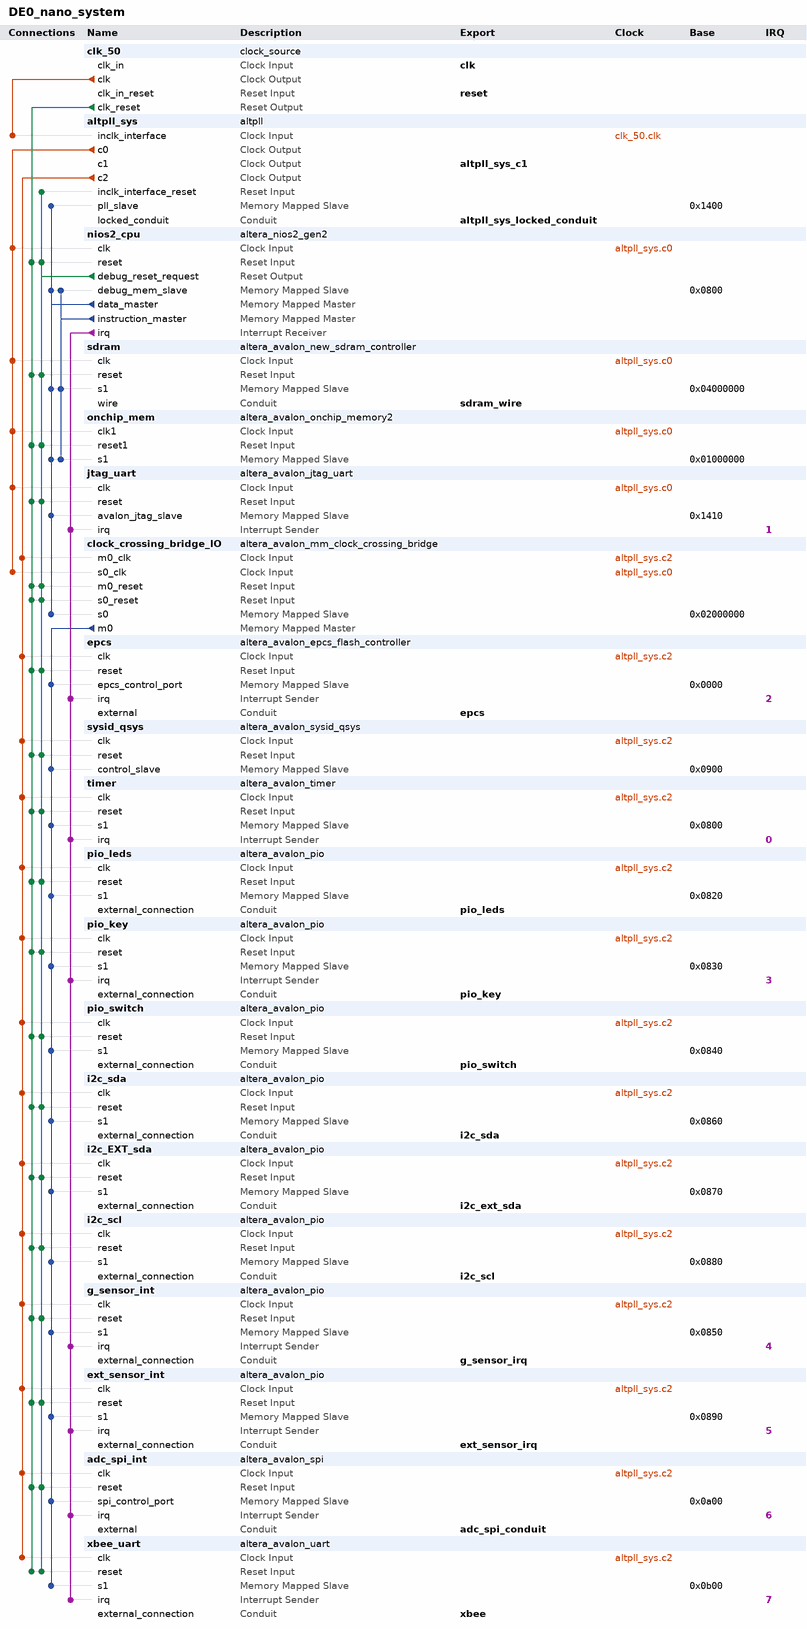
[diagram p0: system contents]
# Platform Designer (Qsys) system DE0_nano_system, Cyclone IV E EP4CE22F17C6
# Parameters at their usual value, and those the tool derives, are not listed.
package require -exact qsys 17.1
create_system DE0_nano_system
set_project_property DEVICE_FAMILY {Cyclone IV E}
set_project_property DEVICE EP4CE22F17C6

add_instance clk_50 clock_source 17.1
set_instance_parameter_value clk_50 clockFrequency 50000000

add_instance altpll_sys altpll 17.1
set_instance_parameter_value altpll_sys CLK0_DIVIDE_BY 1
set_instance_parameter_value altpll_sys CLK0_MULTIPLY_BY 2
set_instance_parameter_value altpll_sys CLK1_DIVIDE_BY 1
set_instance_parameter_value altpll_sys CLK1_DUTY_CYCLE 50
set_instance_parameter_value altpll_sys CLK1_MULTIPLY_BY 2
set_instance_parameter_value altpll_sys CLK1_PHASE_SHIFT -1667
set_instance_parameter_value altpll_sys CLK2_DIVIDE_BY 5
set_instance_parameter_value altpll_sys CLK2_DUTY_CYCLE 50
set_instance_parameter_value altpll_sys CLK2_MULTIPLY_BY 1
set_instance_parameter_value altpll_sys CLK2_PHASE_SHIFT 0
set_instance_parameter_value altpll_sys INCLK0_INPUT_FREQUENCY 20000
set_instance_parameter_value altpll_sys PORT_ARESET PORT_UNUSED
set_instance_parameter_value altpll_sys PORT_LOCKED PORT_USED
set_instance_parameter_value altpll_sys PORT_clk1 PORT_USED
set_instance_parameter_value altpll_sys PORT_clk2 PORT_USED
set_instance_parameter_value altpll_sys PORT_clk3 PORT_UNUSED

add_instance nios2_cpu altera_nios2_gen2 17.1
set_instance_parameter_value nios2_cpu dcache_size 2048
set_instance_parameter_value nios2_cpu exceptionSlave onchip_mem.s1
set_instance_parameter_value nios2_cpu icache_size 4096
set_instance_parameter_value nios2_cpu impl Fast
set_instance_parameter_value nios2_cpu resetSlave onchip_mem.s1
set_instance_parameter_value nios2_cpu setting_shadowRegisterSets 1

add_instance sdram altera_avalon_new_sdram_controller 17.1
set_instance_parameter_value sdram TAC 5.5
set_instance_parameter_value sdram TRCD 20.0
set_instance_parameter_value sdram TRP 20.0
set_instance_parameter_value sdram casLatency 3
set_instance_parameter_value sdram columnWidth 9
set_instance_parameter_value sdram dataWidth 16
set_instance_parameter_value sdram generateSimulationModel false
set_instance_parameter_value sdram model custom
set_instance_parameter_value sdram numberOfBanks 4
set_instance_parameter_value sdram numberOfChipSelects 1
set_instance_parameter_value sdram powerUpDelay 100.0
set_instance_parameter_value sdram refreshPeriod 15.625
set_instance_parameter_value sdram rowWidth 13

add_instance onchip_mem altera_avalon_onchip_memory2 17.1
set_instance_parameter_value onchip_mem dataWidth 32
set_instance_parameter_value onchip_mem dualPort false
set_instance_parameter_value onchip_mem initMemContent true
set_instance_parameter_value onchip_mem initializationFileName onchip_mem
set_instance_parameter_value onchip_mem memorySize 4096

add_instance jtag_uart altera_avalon_jtag_uart 17.1
set_instance_parameter_value jtag_uart simInteractiveOptions INTERACTIVE_ASCII_OUTPUT

add_instance clock_crossing_bridge_IO altera_avalon_mm_clock_crossing_bridge 17.1
set_instance_parameter_value clock_crossing_bridge_IO ADDRESS_WIDTH 12
set_instance_parameter_value clock_crossing_bridge_IO COMMAND_FIFO_DEPTH 16
set_instance_parameter_value clock_crossing_bridge_IO DATA_WIDTH 32
set_instance_parameter_value clock_crossing_bridge_IO MASTER_SYNC_DEPTH 3
set_instance_parameter_value clock_crossing_bridge_IO MAX_BURST_SIZE 1
set_instance_parameter_value clock_crossing_bridge_IO RESPONSE_FIFO_DEPTH 32
set_instance_parameter_value clock_crossing_bridge_IO SLAVE_SYNC_DEPTH 3
set_instance_parameter_value clock_crossing_bridge_IO USE_AUTO_ADDRESS_WIDTH 0

add_instance epcs altera_avalon_epcs_flash_controller 17.1
set_instance_parameter_value epcs autoSelectASMIAtom false
set_instance_parameter_value epcs resetrequest_enabled true

add_instance sysid_qsys altera_avalon_sysid_qsys 17.1
set_instance_parameter_value sysid_qsys id 0

add_instance timer altera_avalon_timer 17.1
set_instance_parameter_value timer period 1
set_instance_parameter_value timer periodUnits MSEC

add_instance pio_leds altera_avalon_pio 17.1
set_instance_parameter_value pio_leds direction Output
set_instance_parameter_value pio_leds width 8

add_instance pio_key altera_avalon_pio 17.1
set_instance_parameter_value pio_key bitClearingEdgeCapReg true
set_instance_parameter_value pio_key captureEdge true
set_instance_parameter_value pio_key direction Input
set_instance_parameter_value pio_key generateIRQ true
set_instance_parameter_value pio_key irqType EDGE
set_instance_parameter_value pio_key width 2

add_instance pio_switch altera_avalon_pio 17.1
set_instance_parameter_value pio_switch direction Input
set_instance_parameter_value pio_switch width 4

add_instance i2c_sda altera_avalon_pio 17.1
set_instance_parameter_value i2c_sda direction Bidir
set_instance_parameter_value i2c_sda resetValue 1
set_instance_parameter_value i2c_sda width 1

add_instance i2c_EXT_sda altera_avalon_pio 17.1
set_instance_parameter_value i2c_EXT_sda direction Bidir
set_instance_parameter_value i2c_EXT_sda resetValue 1
set_instance_parameter_value i2c_EXT_sda width 1

add_instance i2c_scl altera_avalon_pio 17.1
set_instance_parameter_value i2c_scl direction Output
set_instance_parameter_value i2c_scl resetValue 1
set_instance_parameter_value i2c_scl width 1

add_instance g_sensor_int altera_avalon_pio 17.1
set_instance_parameter_value g_sensor_int captureEdge true
set_instance_parameter_value g_sensor_int direction Input
set_instance_parameter_value g_sensor_int generateIRQ true
set_instance_parameter_value g_sensor_int irqType EDGE
set_instance_parameter_value g_sensor_int width 1

add_instance ext_sensor_int altera_avalon_pio 17.1
set_instance_parameter_value ext_sensor_int captureEdge true
set_instance_parameter_value ext_sensor_int direction Input
set_instance_parameter_value ext_sensor_int edgeType FALLING
set_instance_parameter_value ext_sensor_int generateIRQ true
set_instance_parameter_value ext_sensor_int irqType EDGE
set_instance_parameter_value ext_sensor_int width 1

add_instance adc_spi_int altera_avalon_spi 17.1
set_instance_parameter_value adc_spi_int clockPolarity 0
set_instance_parameter_value adc_spi_int dataWidth 8
set_instance_parameter_value adc_spi_int masterSPI true
set_instance_parameter_value adc_spi_int numberOfSlaves 1
set_instance_parameter_value adc_spi_int targetClockRate 1250000

add_instance xbee_uart altera_avalon_uart 17.1
set_instance_parameter_value xbee_uart baud 9600
set_instance_parameter_value xbee_uart dataBits 8
set_instance_parameter_value xbee_uart fixedBaud true
set_instance_parameter_value xbee_uart parity NONE
set_instance_parameter_value xbee_uart stopBits 1

# connections
add_connection altpll_sys.c0 clock_crossing_bridge_IO.s0_clk clock
add_connection altpll_sys.c0 jtag_uart.clk clock
add_connection altpll_sys.c0 nios2_cpu.clk clock
add_connection altpll_sys.c0 onchip_mem.clk1 clock
add_connection altpll_sys.c0 sdram.clk clock
add_connection altpll_sys.c2 adc_spi_int.clk clock
add_connection altpll_sys.c2 clock_crossing_bridge_IO.m0_clk clock
add_connection altpll_sys.c2 epcs.clk clock
add_connection altpll_sys.c2 ext_sensor_int.clk clock
add_connection altpll_sys.c2 g_sensor_int.clk clock
add_connection altpll_sys.c2 i2c_EXT_sda.clk clock
add_connection altpll_sys.c2 i2c_scl.clk clock
add_connection altpll_sys.c2 i2c_sda.clk clock
add_connection altpll_sys.c2 pio_key.clk clock
add_connection altpll_sys.c2 pio_leds.clk clock
add_connection altpll_sys.c2 pio_switch.clk clock
add_connection altpll_sys.c2 sysid_qsys.clk clock
add_connection altpll_sys.c2 timer.clk clock
add_connection altpll_sys.c2 xbee_uart.clk clock
add_connection clk_50.clk altpll_sys.inclk_interface clock
add_connection clk_50.clk_reset adc_spi_int.reset reset
add_connection clk_50.clk_reset clock_crossing_bridge_IO.m0_reset reset
add_connection clk_50.clk_reset clock_crossing_bridge_IO.s0_reset reset
add_connection clk_50.clk_reset epcs.reset reset
add_connection clk_50.clk_reset ext_sensor_int.reset reset
add_connection clk_50.clk_reset g_sensor_int.reset reset
add_connection clk_50.clk_reset i2c_EXT_sda.reset reset
add_connection clk_50.clk_reset i2c_scl.reset reset
add_connection clk_50.clk_reset i2c_sda.reset reset
add_connection clk_50.clk_reset jtag_uart.reset reset
add_connection clk_50.clk_reset nios2_cpu.reset reset
add_connection clk_50.clk_reset onchip_mem.reset1 reset
add_connection clk_50.clk_reset pio_key.reset reset
add_connection clk_50.clk_reset pio_leds.reset reset
add_connection clk_50.clk_reset pio_switch.reset reset
add_connection clk_50.clk_reset sdram.reset reset
add_connection clk_50.clk_reset sysid_qsys.reset reset
add_connection clk_50.clk_reset timer.reset reset
add_connection clk_50.clk_reset xbee_uart.reset reset
add_connection nios2_cpu.debug_reset_request adc_spi_int.reset reset
add_connection nios2_cpu.debug_reset_request altpll_sys.inclk_interface_reset reset
add_connection nios2_cpu.debug_reset_request clock_crossing_bridge_IO.m0_reset reset
add_connection nios2_cpu.debug_reset_request clock_crossing_bridge_IO.s0_reset reset
add_connection nios2_cpu.debug_reset_request epcs.reset reset
add_connection nios2_cpu.debug_reset_request ext_sensor_int.reset reset
add_connection nios2_cpu.debug_reset_request g_sensor_int.reset reset
add_connection nios2_cpu.debug_reset_request i2c_EXT_sda.reset reset
add_connection nios2_cpu.debug_reset_request i2c_scl.reset reset
add_connection nios2_cpu.debug_reset_request i2c_sda.reset reset
add_connection nios2_cpu.debug_reset_request jtag_uart.reset reset
add_connection nios2_cpu.debug_reset_request nios2_cpu.reset reset
add_connection nios2_cpu.debug_reset_request onchip_mem.reset1 reset
add_connection nios2_cpu.debug_reset_request pio_key.reset reset
add_connection nios2_cpu.debug_reset_request pio_leds.reset reset
add_connection nios2_cpu.debug_reset_request pio_switch.reset reset
add_connection nios2_cpu.debug_reset_request sdram.reset reset
add_connection nios2_cpu.debug_reset_request sysid_qsys.reset reset
add_connection nios2_cpu.debug_reset_request timer.reset reset
add_connection nios2_cpu.debug_reset_request xbee_uart.reset reset
add_connection clock_crossing_bridge_IO.m0 adc_spi_int.spi_control_port avalon
set_connection_parameter_value clock_crossing_bridge_IO.m0/adc_spi_int.spi_control_port baseAddress 0x0a00
add_connection clock_crossing_bridge_IO.m0 epcs.epcs_control_port avalon
set_connection_parameter_value clock_crossing_bridge_IO.m0/epcs.epcs_control_port baseAddress 0x0000
add_connection clock_crossing_bridge_IO.m0 ext_sensor_int.s1 avalon
set_connection_parameter_value clock_crossing_bridge_IO.m0/ext_sensor_int.s1 baseAddress 0x0890
add_connection clock_crossing_bridge_IO.m0 g_sensor_int.s1 avalon
set_connection_parameter_value clock_crossing_bridge_IO.m0/g_sensor_int.s1 baseAddress 0x0850
add_connection clock_crossing_bridge_IO.m0 i2c_EXT_sda.s1 avalon
set_connection_parameter_value clock_crossing_bridge_IO.m0/i2c_EXT_sda.s1 baseAddress 0x0870
add_connection clock_crossing_bridge_IO.m0 i2c_scl.s1 avalon
set_connection_parameter_value clock_crossing_bridge_IO.m0/i2c_scl.s1 baseAddress 0x0880
add_connection clock_crossing_bridge_IO.m0 i2c_sda.s1 avalon
set_connection_parameter_value clock_crossing_bridge_IO.m0/i2c_sda.s1 baseAddress 0x0860
add_connection clock_crossing_bridge_IO.m0 pio_key.s1 avalon
set_connection_parameter_value clock_crossing_bridge_IO.m0/pio_key.s1 baseAddress 0x0830
add_connection clock_crossing_bridge_IO.m0 pio_leds.s1 avalon
set_connection_parameter_value clock_crossing_bridge_IO.m0/pio_leds.s1 baseAddress 0x0820
add_connection clock_crossing_bridge_IO.m0 pio_switch.s1 avalon
set_connection_parameter_value clock_crossing_bridge_IO.m0/pio_switch.s1 baseAddress 0x0840
add_connection clock_crossing_bridge_IO.m0 sysid_qsys.control_slave avalon
set_connection_parameter_value clock_crossing_bridge_IO.m0/sysid_qsys.control_slave baseAddress 0x0900
add_connection clock_crossing_bridge_IO.m0 timer.s1 avalon
set_connection_parameter_value clock_crossing_bridge_IO.m0/timer.s1 baseAddress 0x0800
add_connection clock_crossing_bridge_IO.m0 xbee_uart.s1 avalon
set_connection_parameter_value clock_crossing_bridge_IO.m0/xbee_uart.s1 baseAddress 0x0b00
add_connection nios2_cpu.data_master altpll_sys.pll_slave avalon
set_connection_parameter_value nios2_cpu.data_master/altpll_sys.pll_slave baseAddress 0x1400
add_connection nios2_cpu.data_master clock_crossing_bridge_IO.s0 avalon
set_connection_parameter_value nios2_cpu.data_master/clock_crossing_bridge_IO.s0 baseAddress 0x02000000
add_connection nios2_cpu.data_master jtag_uart.avalon_jtag_slave avalon
set_connection_parameter_value nios2_cpu.data_master/jtag_uart.avalon_jtag_slave baseAddress 0x1410
add_connection nios2_cpu.data_master nios2_cpu.debug_mem_slave avalon
set_connection_parameter_value nios2_cpu.data_master/nios2_cpu.debug_mem_slave baseAddress 0x0800
add_connection nios2_cpu.data_master onchip_mem.s1 avalon
set_connection_parameter_value nios2_cpu.data_master/onchip_mem.s1 baseAddress 0x01000000
add_connection nios2_cpu.data_master sdram.s1 avalon
set_connection_parameter_value nios2_cpu.data_master/sdram.s1 baseAddress 0x04000000
add_connection nios2_cpu.instruction_master nios2_cpu.debug_mem_slave avalon
set_connection_parameter_value nios2_cpu.instruction_master/nios2_cpu.debug_mem_slave baseAddress 0x0800
add_connection nios2_cpu.instruction_master onchip_mem.s1 avalon
set_connection_parameter_value nios2_cpu.instruction_master/onchip_mem.s1 baseAddress 0x01000000
add_connection nios2_cpu.instruction_master sdram.s1 avalon
set_connection_parameter_value nios2_cpu.instruction_master/sdram.s1 baseAddress 0x04000000
add_connection nios2_cpu.irq adc_spi_int.irq interrupt
set_connection_parameter_value nios2_cpu.irq/adc_spi_int.irq irqNumber 6
add_connection nios2_cpu.irq epcs.irq interrupt
set_connection_parameter_value nios2_cpu.irq/epcs.irq irqNumber 2
add_connection nios2_cpu.irq ext_sensor_int.irq interrupt
set_connection_parameter_value nios2_cpu.irq/ext_sensor_int.irq irqNumber 5
add_connection nios2_cpu.irq g_sensor_int.irq interrupt
set_connection_parameter_value nios2_cpu.irq/g_sensor_int.irq irqNumber 4
add_connection nios2_cpu.irq jtag_uart.irq interrupt
set_connection_parameter_value nios2_cpu.irq/jtag_uart.irq irqNumber 1
add_connection nios2_cpu.irq pio_key.irq interrupt
set_connection_parameter_value nios2_cpu.irq/pio_key.irq irqNumber 3
add_connection nios2_cpu.irq timer.irq interrupt
set_connection_parameter_value nios2_cpu.irq/timer.irq irqNumber 0
add_connection nios2_cpu.irq xbee_uart.irq interrupt
set_connection_parameter_value nios2_cpu.irq/xbee_uart.irq irqNumber 7

# exported interfaces
add_interface adc_spi_conduit conduit end
set_interface_property adc_spi_conduit EXPORT_OF adc_spi_int.external
add_interface altpll_sys_c1 clock source
set_interface_property altpll_sys_c1 EXPORT_OF altpll_sys.c1
add_interface altpll_sys_locked_conduit conduit end
set_interface_property altpll_sys_locked_conduit EXPORT_OF altpll_sys.locked_conduit
add_interface clk clock sink
set_interface_property clk EXPORT_OF clk_50.clk_in
add_interface epcs conduit end
set_interface_property epcs EXPORT_OF epcs.external
add_interface ext_sensor_irq conduit end
set_interface_property ext_sensor_irq EXPORT_OF ext_sensor_int.external_connection
add_interface g_sensor_irq conduit end
set_interface_property g_sensor_irq EXPORT_OF g_sensor_int.external_connection
add_interface i2c_ext_sda conduit end
set_interface_property i2c_ext_sda EXPORT_OF i2c_EXT_sda.external_connection
add_interface i2c_scl conduit end
set_interface_property i2c_scl EXPORT_OF i2c_scl.external_connection
add_interface i2c_sda conduit end
set_interface_property i2c_sda EXPORT_OF i2c_sda.external_connection
add_interface pio_key conduit end
set_interface_property pio_key EXPORT_OF pio_key.external_connection
add_interface pio_leds conduit end
set_interface_property pio_leds EXPORT_OF pio_leds.external_connection
add_interface pio_switch conduit end
set_interface_property pio_switch EXPORT_OF pio_switch.external_connection
add_interface reset reset sink
set_interface_property reset EXPORT_OF clk_50.clk_in_reset
add_interface sdram_wire conduit end
set_interface_property sdram_wire EXPORT_OF sdram.wire
add_interface xbee conduit end
set_interface_property xbee EXPORT_OF xbee_uart.external_connection

set_interconnect_requirement {$system} qsys_mm.clockCrossingAdapter HANDSHAKE
set_interconnect_requirement {$system} qsys_mm.maxAdditionalLatency 1

save_system DE0_nano_system.qsys
